# Altium schematic sheet Function.SchDoc
size A4; SheetNumber: 3; SheetTotal: 3
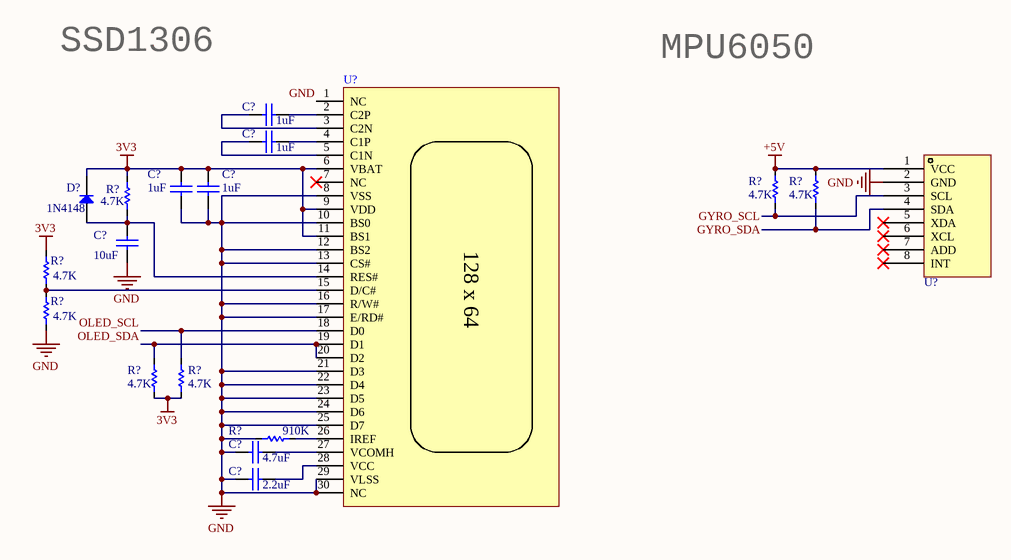
[diagram p0: Function.SchDoc]

## Parts
(Parts that share a designator on the sheet are numbered #1, #2 ... from top to bottom, then left to right.)
C?#1  value 1uF  [C0603]  (hidden comment: Cap)
C?#2  value 1uF  [C0603]  (hidden comment: Cap)
C?#3  value 1uF  [C0603]  (hidden comment: Cap)
C?#4  value 1uF  [C0603]  (hidden comment: Cap)
C?#5  value 10uF  [C0603]  (hidden comment: Cap)
C?#6  value 4.7uF  [C0603]  (hidden comment: Cap)
C?#7  value 2.2uF  [C0603]  (hidden comment: Cap)
D?  1N4148  [SOD-523F]
R?#1  value 4.7K  [R0402]  (hidden comment: Res)
R?#2  4.7K  [R0402]
R?#3  4.7K  [R0402]
R?#4  value 4.7K  [R0402]  (hidden comment: Res)
R?#5  value 4.7K  [R0402]  (hidden comment: Res)
R?#6  value 4.7K  [R0402]  (hidden comment: Res)
R?#7  value 4.7K  [R0402]  (hidden comment: Res)
R?#8  value 910K  [R0402]  (hidden comment: Res)
U?#1  MPU6050  [MPU6050]  (value not drawn)
U?#2  VG-2864KSWEG01  [SSD1306]  (value not drawn)

## Nets
3V3: C?#3.1 C?#4.1 D?.1(K) R?#1.1 R?#4.1 R?#6.2 R?#7.2 U?#2.6(VBAT) U?#2.9(VDD) U?#2.11(BS1)
+5V: R?#2.2 R?#3.2 U?#1.1(VCC)
GND: C?#3.2 C?#4.2 C?#5.2 C?#6.2 C?#7.2 R?#5.2 R?#8.1 U?#1.2(GND) U?#2.1(NC) U?#2.8(VSS) U?#2.10(BS0) U?#2.12(BS2) U?#2.13(CS#) U?#2.16(R/W#) U?#2.17(E/RD#) U?#2.21(D3) U?#2.22(D4) U?#2.23(D5) U?#2.24(D6) U?#2.25(D7) U?#2.29(VLSS) U?#2.30(NC)
GYRO_SCL: R?#2.1 U?#1.3(SCL)
GYRO_SDA: R?#3.1 U?#1.4(SDA)
OLED_SCL: R?#7.1 U?#2.18(D0)
OLED_SDA: R?#6.1 U?#2.19(D1) U?#2.20(D2)
NetC?#1_1: C?#1.1 U?#2.2(C2P)
NetC?#1_2: C?#1.2 U?#2.3(C2N)
NetC?#2_1: C?#2.1 U?#2.4(C1P)
NetC?#2_2: C?#2.2 U?#2.5(C1N)
NetC?#5_1: C?#5.1 D?.2(A) R?#1.2 U?#2.14(RES#)
NetC?#6_1: C?#6.1 U?#2.27(VCOMH)
NetC?#7_1: C?#7.1 U?#2.28(VCC)
NetR?#4_2: R?#4.2 R?#5.1 U?#2.15(D/C#)
NetR?#8_2: R?#8.2 U?#2.26(IREF)

Not connected (* = marked no-connect by the designer): U?#1 5(XDA)* 6(XCL)* 7(ADD)* 8(INT)*; U?#2 7(NC)*

## Notes on the sheet
- SSD1306
- MPU6050
- (near C?#5) The I2C slave address is 0x78.
  If the customer ties D/C# pin to VCC, the I2C slave address will be 0x7a.
- (in symbol SSD1306) 128 x 64

## Library data of the parts
C?#1-C?#7 = Cap: Capacitor; Published: 8-Jun-2000; LatestRevisionDate: 17-Jul-2002; LatestRevisionNote: Re-released for DXP Platform.; PackageReference: RAD-0.3; Publisher: Altium Limited; PackageDescription: Radial Cap, Thru-Hole; 2 Leads; 0.3 in Pin Spacing
D? = Diode: High Conductance Fast Diode; Published: 8-Jun-2000; LatestRevisionDate: 17-Jul-2002; LatestRevisionNote: Re-released for DXP Platform.; DatasheetVersion: 1997; PackageReference: DO-35; Publisher: Altium Limited; PackageDescription: Diode, Axial; Body 3.8 x 1.9 mm (LxDia. max), Lead Dia. 0.53 mm (max); Code_JEDEC: DO-204-AH; ComponentLink1Description: Manufacturer Link; ComponentLink1URL: http://www.fairchildsemi.com/; ComponentLink2Description: Datasheet; ComponentLink2URL: http://www.fairchildsemi.com/ds/1N%2F1N4148.pdf
R?#1-R?#8 = Res: Resistor; Published: 8-Jun-2000; LatestRevisionDate: 17-Jul-2002; LatestRevisionNote: Re-released for DXP Platform.; PackageReference: AXIAL-0.3; Publisher: Altium Limited; PackageDescription: Axial Device, Thru-Hole; 2 Leads; 0.3 in Pin Spacing
  R?#2 R?#3: Value: 4.7K
U?#1 = MPU6050: GY-521
U?#2 = SSD1306: Manufacturer: WiseChip(智晶光电); Add into BOM: yes; Name: VG-2864KSWEG01; Symbol: VG-2864KSWEG01; Device: VG-2864KSWEG01; LCSC Part Name: 0.96”128x64白色 VG-2864KSWEG01; Supplier Part: C194313; Manufacturer Part: VG-2864KSWEG01; Supplier Footprint: -; JLCPCB Part Class: Extended Part; Datasheet: https://atta.szlcsc.com/upload/public/pdf/source/20190118/C194313_EB7CEF44C1C1CB8B071218A368D72B17.pdf; Supplier: LCSC; Convert to PCB: yes; Size: 0.96; Main Control Chip: SSD1306